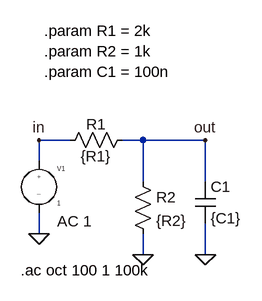
[diagram p0: schematic tp_spann_teiler.asc]
tp_spann_teiler.asc, the LTspice schematic file:
Version 4
SHEET 1 880 680
WIRE 48 112 0 112
WIRE 160 112 128 112
WIRE 256 112 160 112
WIRE 0 144 0 112
WIRE 160 176 160 112
WIRE 256 176 256 112
WIRE 0 256 0 224
WIRE 160 288 160 256
WIRE 256 288 256 240
FLAG 256 288 0
FLAG 160 288 0
FLAG 0 256 0
FLAG 0 112 in
FLAG 256 112 out
SYMBOL res 32 128 R270
WINDOW 0 25 56 VTop 2
WINDOW 3 7 56 VBottom 2
SYMATTR InstName R1
SYMATTR Value {R1}
SYMBOL res 144 160 R0
SYMATTR InstName R2
SYMATTR Value {R2}
SYMBOL cap 240 176 R0
SYMATTR InstName C1
SYMATTR Value {C1}
SYMBOL source-V 0 128 R0
WINDOW 123 28 109 Left 2
WINDOW 39 0 0 Left 2
SYMATTR InstName V1
SYMATTR Value 1
SYMATTR Value2 AC 1
TEXT 8 -56 Left 2 !.param R1 = 2k\n.param R2 = 1k\n.param C1 = 100n
TEXT -28 312 Left 2 !.ac oct 100 1 100k

The netlist it stands for:
* tp_spann_teiler.asc
R1 in out {R1}
R2 out 0 {R2}
C1 out 0 {C1}
V1 in 0 1 AC 1
.param R1 = 2k
.param R2 = 1k
.param C1 = 100n
.ac oct 100 1 100k
.backanno
.end